# EAGLE schematic Fuseboard (EAGLE 9.2.2)
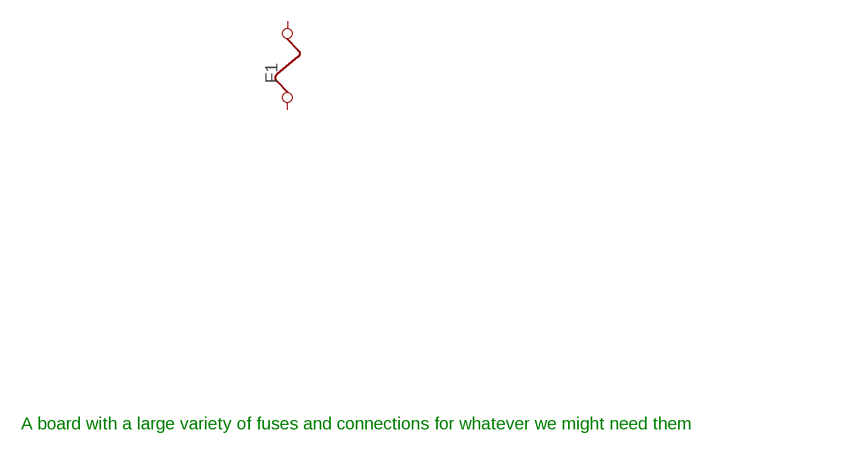
[diagram p0: schematic, sheet 1]

## Parts
F1  FUSE  [FUSE]
Unconnected: F1.1 F1.2

## Notes on the sheet
- A board with a large variety of fuses and connections for whatever we might need them

## Library data of the parts
F1 = special:FUSE: FUSE 5 x 20 mm